# Altium schematic sheet AMS1117-3.31_AMS1117-3.3.schdoc
size 124 x 101 mm
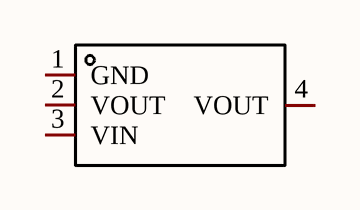
[diagram p0: AMS1117-3.31_AMS1117-3.3.schdoc]

## Parts
U?  AMS1117-3.3  [SOT-223-3_L6.5-W3.4-P2.30-LS7.0-BR]  (value not drawn)

## Nets

Not connected (* = marked no-connect by the designer): U? 1(GND) 2(VOUT) 3(VIN) 4(VOUT)

## Library data of the parts
U? = AMS1117-3.3_C6186: Manufacturer: AMS; Add into BOM: yes; Output Type: 固定; Output Voltage: 3.3V; MAX Output Current: 1A; Power Supply Rejection Ratio (PSRR): 72dB@(120Hz); Dropout Voltage: 1.3V@(800mA); Output Polarity: 正极; Number of Outputs: 1; Symbol: AMS1117-3.3; Device: AMS1117-3.3_C6186; LCSC Part Name: 输出3.3V 1A; Supplier Part: C6186; Manufacturer Part: AMS1117-3.3; Supplier Footprint: SOT-223; JLCPCB Part Class: Basic Part; Datasheet: https://atta.szlcsc.com/upload/public/pdf/source/20180727/C6186_7A095716F0823C02F1997A905E26C086.pdf; Supplier: LCSC; Convert to PCB: yes; Maximum Input Voltage: -; standby current: -; Noise: -; Feature: -; Operating Temperature: -